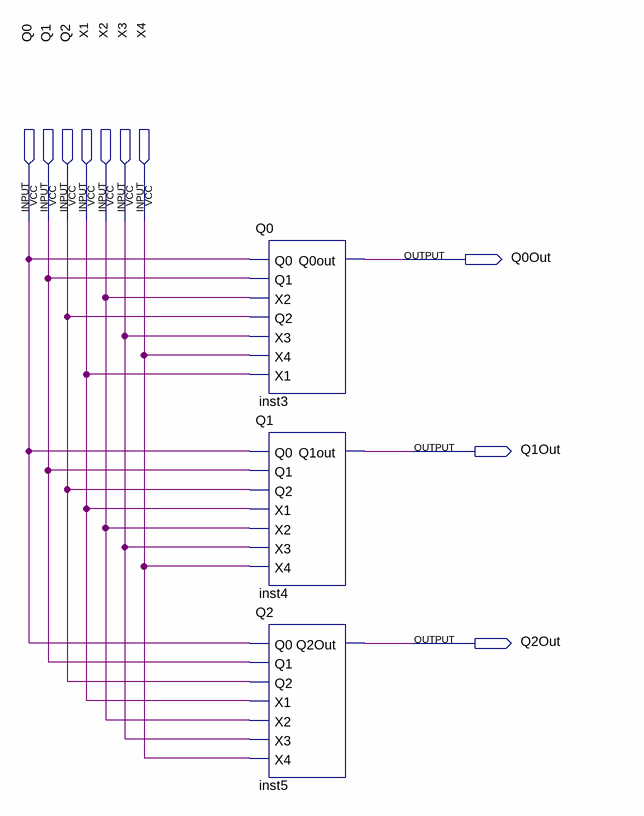
[diagram p0: schematic sheet]
// Quartus schematic QX_to_Q.bdf as structural Verilog: 3 symbols, 10 pins
module QX_to_Q (
  input  Q0,
  input  Q1,
  input  Q2,
  input  X1,
  input  X2,
  input  X3,
  input  X4,
  output Q0Out,
  output Q1Out,
  output Q2Out
);

  Q0 inst3 (.Q0(Q0), .Q1(Q1), .X2(X2), .Q2(Q2), .X3(X3), .X4(X4), .X1(X1), .Q0out(Q0Out));
  Q1 inst4 (.Q0(Q0), .Q1(Q1), .Q2(Q2), .X1(X1), .X2(X2), .X3(X3), .X4(X4), .Q1out(Q1Out));
  Q2 inst5 (.Q0(Q0), .Q1(Q1), .Q2(Q2), .X1(X1), .X2(X2), .X3(X3), .X4(X4), .Q2Out(Q2Out));
endmodule
